# EAGLE design ultra-low-noise-psu-pos-v0001 (EAGLE 6.4)
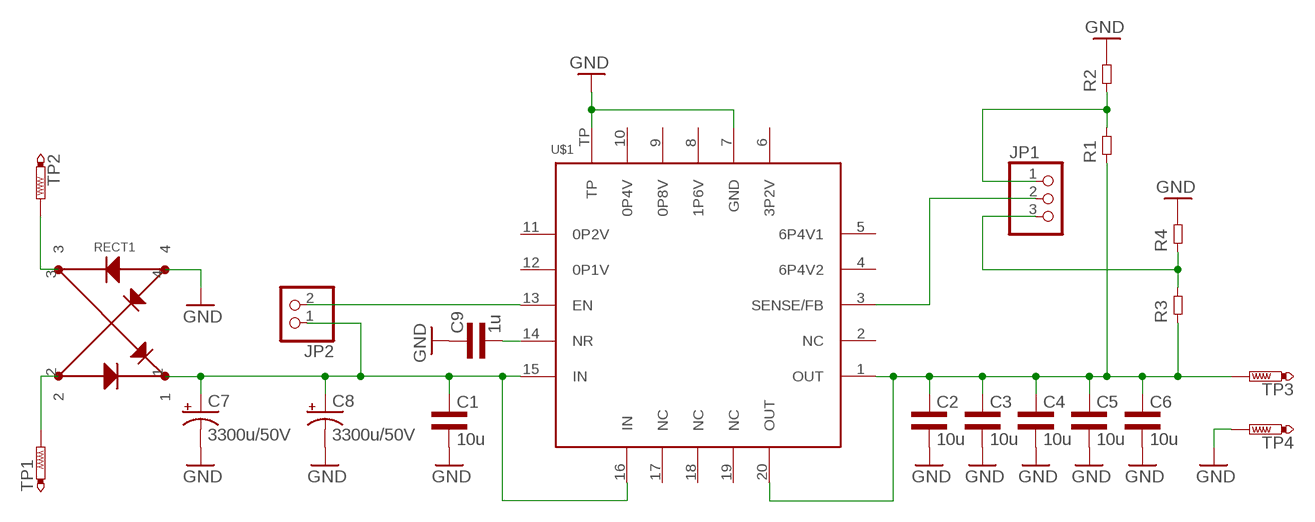
[diagram p0: schematic, sheet 1]

## Parts
C1  10u  CAP0805L3  [0805L3]
C2  10u  CAP0805L3  [0805L3]
C3  10u  CAP0805L3  [0805L3]
C4  10u  CAP0805L3  [0805L3]
C5  10u  CAP0805L3  [0805L3]
C6  10u  CAP0805L3  [0805L3]
C7  3300u/50V  CPOL-USE7.5-18  [E7,5-18]
C8  3300u/50V  CPOL-USE7.5-18  [E7,5-18]
C9  1u  CAP0603L3  [0603L3]
JP1  PINHD-1X3  [1X03]
JP2  PINHD-1X2  [1X02]
R1  RES0603L3  [0603L3]
R2  RES0603L3  [0603L3]
R3  RES0603L3  [0603L3]
R4  RES0603L3  [0603L3]
RECT1  RECTIFIER_Z4GP206  [RECTIFIER_ABS-4]
TP1  PTR1PAD1-20  [P1-20]
TP2  PTR1PAD1-20  [P1-20]
TP3  PTR1PAD1-20  [P1-20]
TP4  PTR1PAD1-20  [P1-20]
U$1  POWER-SUPPLY_POS_V1_TI_LDO_TPS7A4700  [POWER-SUPPLY_POS_V1_TI_LDO_VQFN-20]

## Nets
GND: C1.2 C2.2 C3.2 C4.2 C5.2 C6.2 C7.- C8.- C9.P$1 R2.P$2 R4.P$2 RECT1.4 TP4.TP U$1.7(GND) U$1.TP
N$1: C1.1 C7.+ C8.+ JP2.1 RECT1.1 U$1.15(IN) U$1.16(IN)
N$2: C2.1 C3.1 C4.1 C5.1 C6.1 R1.P$1 R3.P$1 TP3.TP U$1.1(OUT) U$1.20(OUT)
N$3: JP2.2 U$1.13(EN)
N$4: C9.P$2 U$1.14(NR)
N$5: JP1.2 U$1.3(SENSE/FB)
N$6: JP1.3 R3.P$2 R4.P$1
N$7: JP1.1 R1.P$2 R2.P$1
N$9: RECT1.2 TP1.TP
N$10: RECT1.3 TP2.TP
Unconnected: U$1.2(NC) U$1.4(6P4V2) U$1.5(6P4V1) U$1.6(3P2V) U$1.8(1P6V) U$1.9(0P8V) U$1.10(0P4V) U$1.11(0P2V) U$1.12(0P1V) U$1.17(NC) U$1.18(NC) U$1.19(NC)

## Library data of the parts
C1-C6 C9 = common:CAP
C7 C8 = rcl:CPOL-US: POLARIZED CAPACITOR, American symbol
JP1 = adafruit:PINHD-1X3: PIN HEADER
JP2 = pinhead:PINHD-1X2: PIN HEADER
R1-R4 = common:RES
RECT1 = my_dac_amp:RECTIFIER_Z4GP206
TP1-TP4 = testpad:PTR1: TEST PIN
U$1 = my_dac_amp:POWER-SUPPLY_POS_V1_TI_LDO_TPS7A4700

## Board
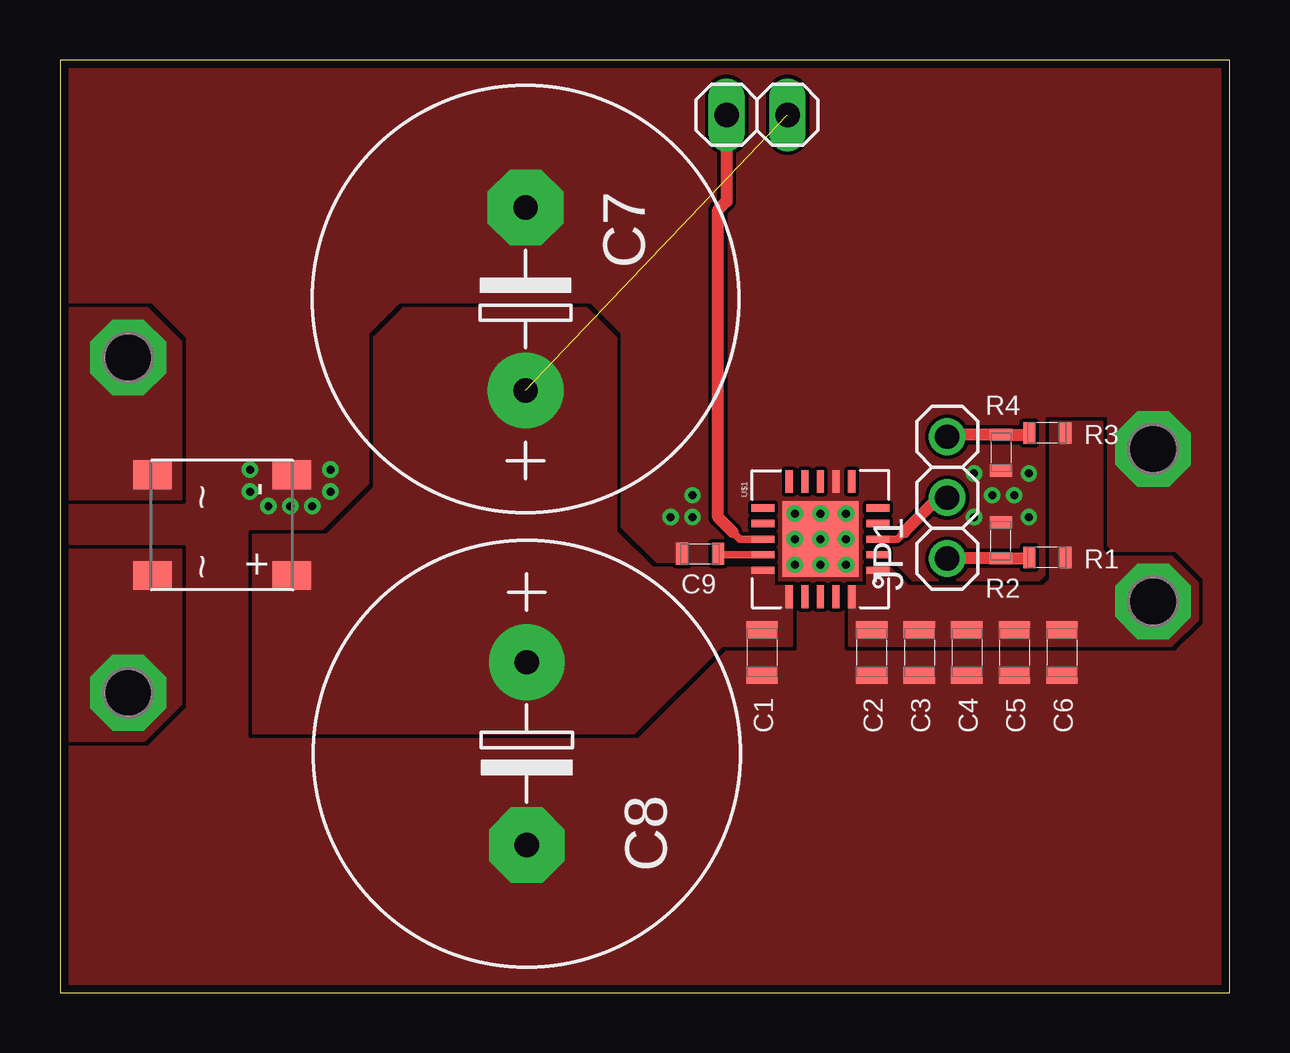
[diagram p1: board, top side]
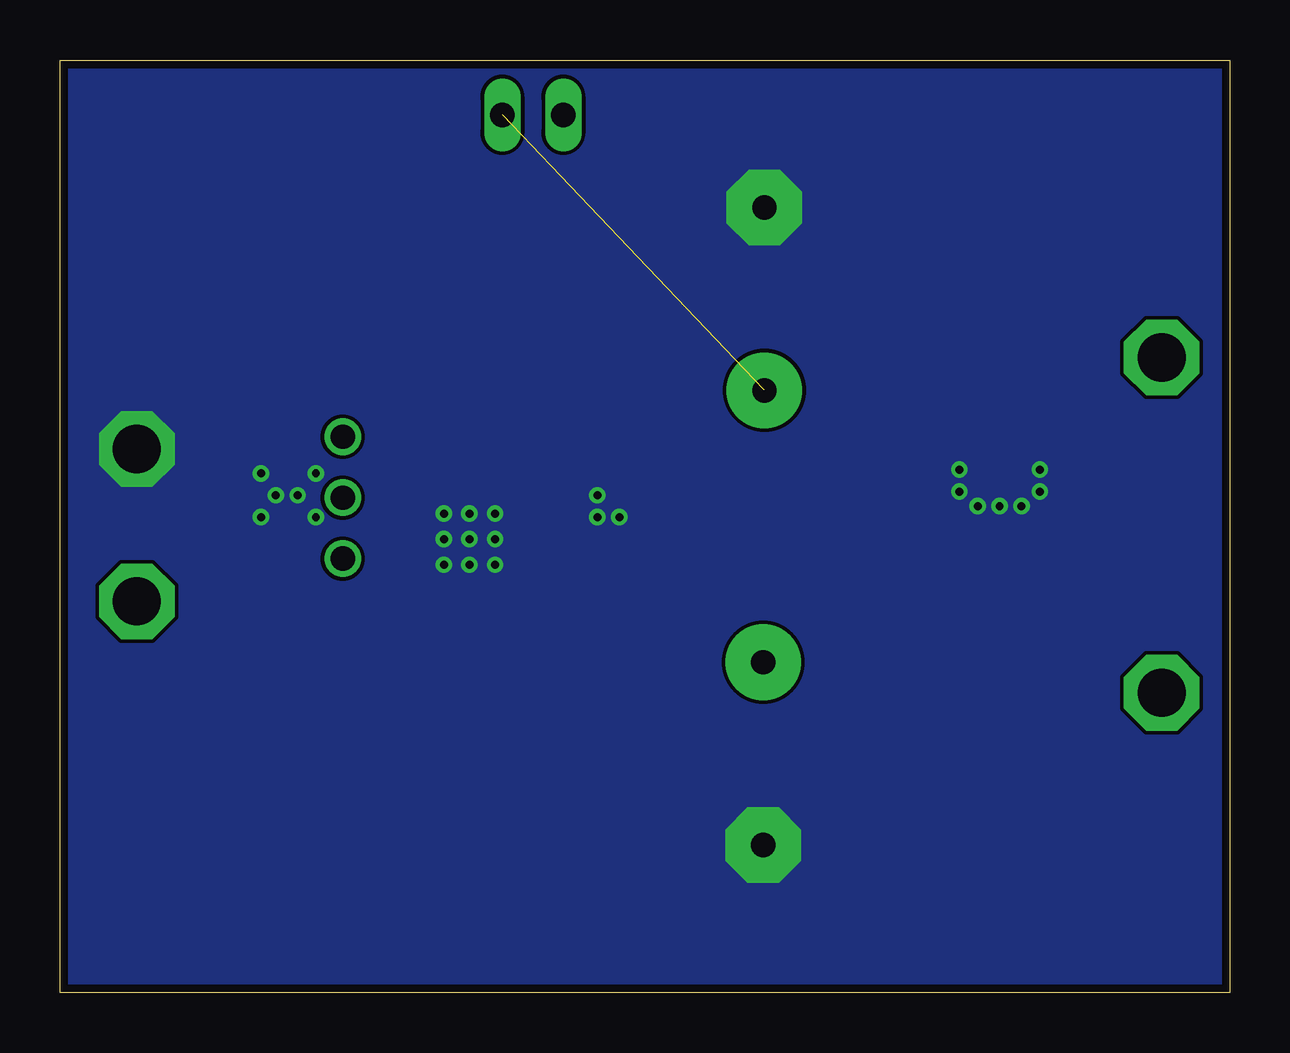
[diagram p2: board, bottom side, seen from below]

Size 48.77 x 38.86 mm. Coordinates in mm from the lower left corner, seen from the top.
Outline: 0,0 48.77,0 48.77,38.86 0,38.86 0,0
Copper layers (1*16): Top 0.035mm / dielectric 1.5mm / Bottom 0.035mm
Design rules "default *": minimum track width 6mil, minimum drill 13mil, track to track 6mil, track to pad 6mil, pad to pad 6mil, via to via 6mil, smd to smd 6mil, copper to edge 13mil, drill to drill 6mil, minimum pad ring 7mil, minimum via ring 7mil, stop-mask expansion 4mil, vias tented up to drill 16mil, thermal gap 10mil

### Footprints (pad centres in the part's own frame; a part is rotated, then mirrored left to right if it is on the bottom)
0805L3 = smd 0.7 x 1.3: 1 -0.95,0; 2 0.95,0
E7,5-18 = drill 1.016 pad 3.15: + -3.81,0 | drill 1.016 pad 3.15 octagon: - 3.81,0
0603L3 = smd 0.5 x 0.9: P$1 -0.75,0; P$2 0.75,0
1X03 = drill 1.016: 1 -2.54,0; 2 0,0; 3 2.54,0
1X02 = drill 1.016 long: 1 -1.27,0; 2 1.27,0
RECTIFIER_ABS-4 = smd 1.2 x 1.6: 1 2.1,2.91; 2 2.1,-2.91; 3 -2.1,-2.91; 4 -2.1,2.91
P1-20 = drill 2.007 pad 3.15 octagon: TP 0,0
POWER-SUPPLY_POS_V1_TI_LDO_VQFN-20 = smd 0.3 x 0.95: 1 -1.3,-2.4; 2 -0.65,-2.4; 3 0,-2.4; 4 0.65,-2.4; 5 1.3,-2.4; 11 1.3,2.4; 12 0.65,2.4; 13 0,2.4; 14 -0.65,2.4; 15 -1.3,2.4 | smd 0.95 x 0.3: 6 2.4,-1.3; 7 2.4,-0.65; 8 2.4,0; 9 2.4,0.65; 10 2.4,1.3; 16 -2.4,1.3; 17 -2.4,0.65; 18 -2.4,0; 19 -2.4,-0.65; 20 -2.4,-1.3 | smd 3.15 x 3.15: TP 0,0

### Placement (x,y rotation side)
C1  29.26,14.17 270 top
C2  33.83,14.17 270 top
C3  35.81,14.17 270 top
C4  37.8,14.17 270 top
C5  39.78,14.17 270 top
C6  41.76,14.17 270 top
C7  19.41,28.91 90 top
C8  19.46,9.96 270 top
C9  26.67,18.29 0 top
JP1  36.98,20.62 90 top
JP2  29.06,36.58 180 top
R1  41.15,18.14 180 top
R2  39.22,18.85 90 top
R3  41.15,23.32 180 top
R4  39.22,22.5 270 top
RECT1  6.76,19.48 270 top
TP1  2.84,12.5 0 top
TP2  2.84,26.47 0 top
TP3  45.57,16.31 0 top
TP4  45.57,22.66 0 top
U$1  31.7,18.9 90 top

### Tracks (layer width: path | path; a pad name or v marks a point on that pad's centre or on a via)
GND  (via drill 0.33)
  other vias: 7.92,21.79 7.92,20.88 8.69,20.27 9.6,20.27 10.52,20.27 11.28,20.88 11.28,21.79 26.37,20.73 25.45,19.81 26.37,19.81 38.86,20.73 40.39,21.64 39.78,20.73 38.1,21.64 40.39,19.81 38.1,19.81 31.7,18.9 30.63,19.96 31.7,19.96 32.77,19.96 30.63,18.9 32.77,18.9 30.63,17.83 31.7,17.83 32.77,17.83
  pour Bottom (rank 6, no thermals): 0.3,38.56 48.46,38.56 48.46,0.3 0.3,0.3
  pour Top (rank 6, no thermals): 0.3,38.56 48.46,38.56 48.46,0.3 0.3,0.3
N$1  (1 unrouted)
  pour Top (no thermals): 8.08,19.05 11.13,19.05 13.11,21.03 13.11,27.28 14.33,28.5 21.95,28.5 23.16,27.28 23.16,19.2 24.69,17.68 29.72,17.68 29.72,16.92 30.48,16.92 30.48,14.48 27.58,14.48 23.93,10.82 8.08,10.82
N$2
  pour Top (no thermals): 33.68,17.68 34.59,17.68 35.36,16.92 41,16.92 41.3,17.22 41.3,23.77 43.43,23.77 43.43,18.44 43.74,18.14 46.33,18.14 47.4,17.07 47.4,15.54 46.33,14.48 32.92,14.48 32.92,16.92 33.68,16.92
N$3
  Top 0.305: U$1.13 28.35,18.9 28.04,19.2
  Top 0.508: 28.04,19.2 27.43,19.81 27.43,32.61 27.79,32.97 JP2.2
N$4
  Top 0.305: U$1.14 27.46,18.25 C9.P$2
N$5
  Top 0.305: 35.2,19.2 34.9,18.9 U$1.3
  Top 0.508: 35.2,19.2 36.58,20.57 36.93,20.57 JP1.2
N$6
  Top 0.508: R3.P$2 40.34,23.25 R4.P$1 37.07,23.25 JP1.3
N$7
  Top 0.508: R1.P$2 40.34,18.1 R2.P$1 JP1.1
N$9
  pour Top (no thermals): 0.3,18.44 0.3,10.52 3.51,10.52 5.03,12.04 5.03,18.44
N$10
  pour Top (no thermals): 0.3,28.5 3.66,28.5 5.03,27.13 5.03,20.57 0.3,20.57